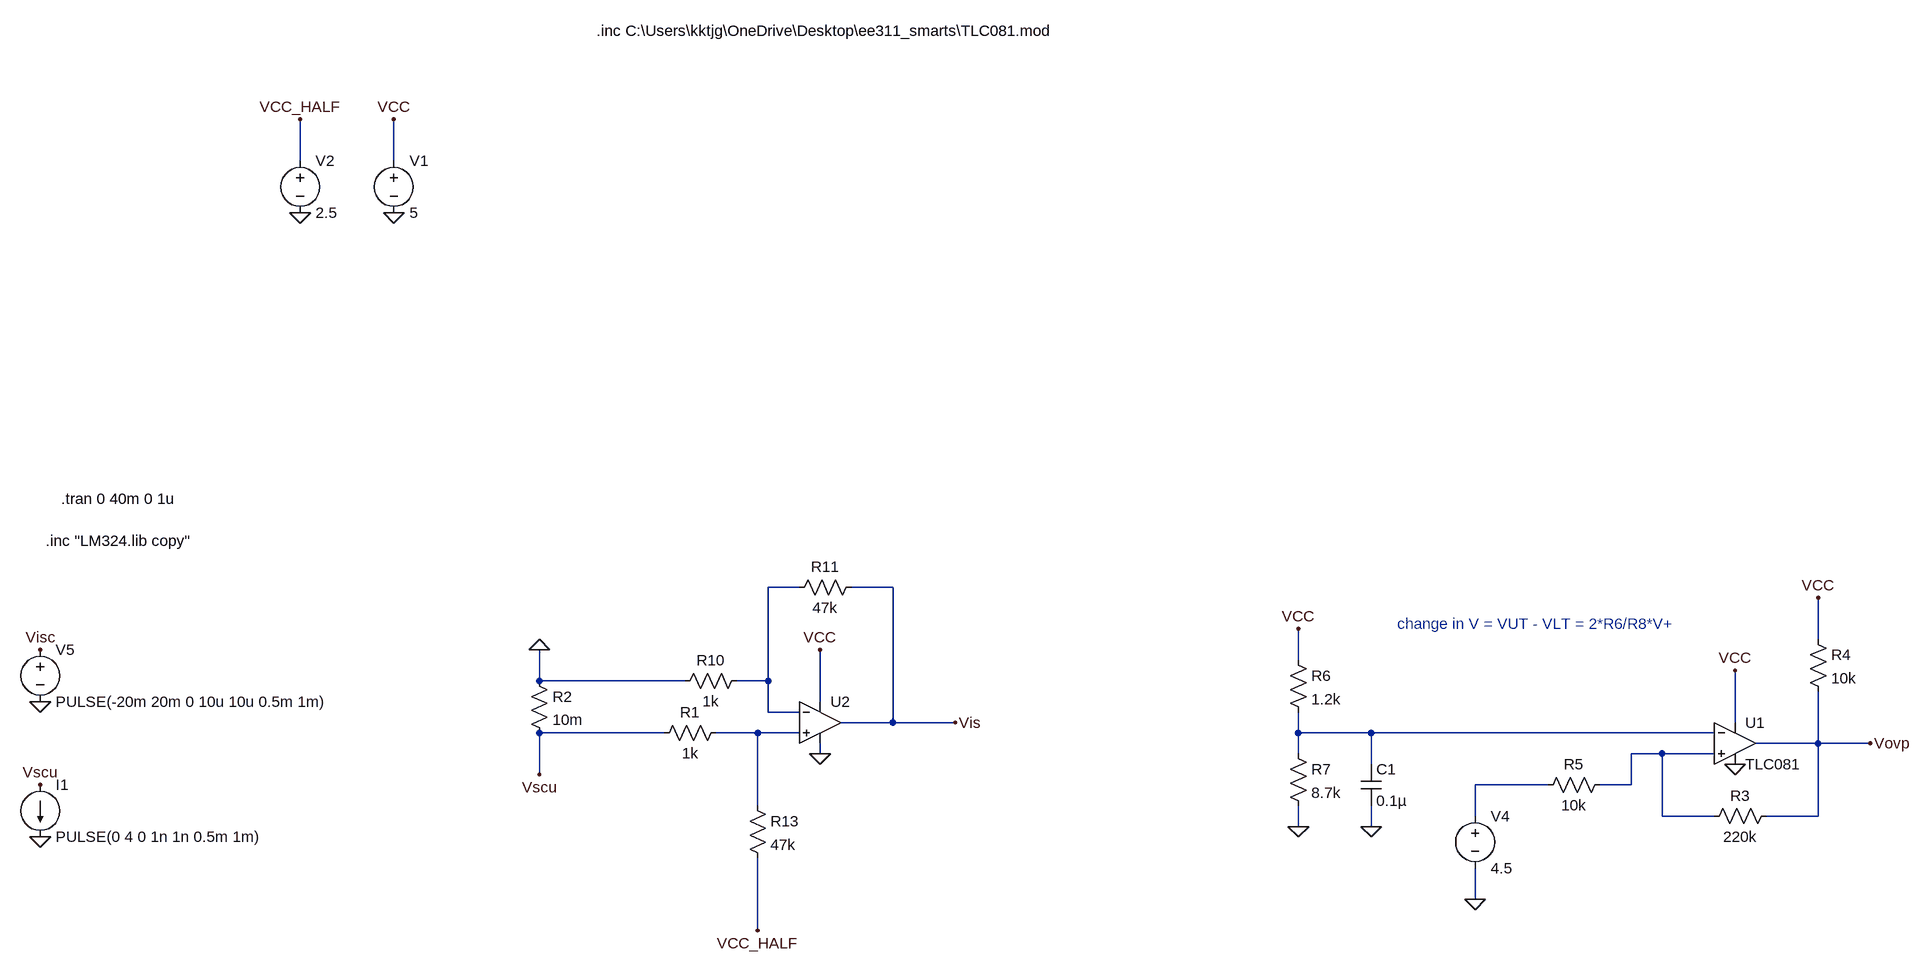
[diagram p0: schematic currentsensing.asc]
currentsensing.asc, the LTspice schematic file:
Version 4.1
SHEET 1 4088 1428
WIRE -736 -224 -736 -288
WIRE -592 -224 -592 -288
WIRE 32 432 -16 432
WIRE 176 432 112 432
WIRE 1600 512 1600 448
WIRE 800 544 800 496
WIRE -368 576 -368 528
WIRE -144 576 -368 576
WIRE -16 576 -16 432
WIRE -16 576 -64 576
WIRE 64 608 64 528
WIRE -16 624 -16 576
WIRE 32 624 -16 624
WIRE 176 640 176 432
WIRE 176 640 96 640
WIRE 272 640 176 640
WIRE 1472 640 1472 560
WIRE -176 656 -368 656
WIRE -32 656 -96 656
WIRE 32 656 -32 656
WIRE 800 656 800 624
WIRE 912 656 800 656
WIRE 1440 656 912 656
WIRE 1600 672 1600 592
WIRE 1600 672 1504 672
WIRE 1680 672 1600 672
WIRE 64 688 64 672
WIRE 800 688 800 656
WIRE 1360 688 1312 688
WIRE 1440 688 1360 688
WIRE 912 704 912 656
WIRE -368 720 -368 656
WIRE 1184 736 1072 736
WIRE 1312 736 1312 688
WIRE 1312 736 1264 736
WIRE -32 768 -32 656
WIRE 1072 784 1072 736
WIRE 1360 784 1360 688
WIRE 1440 784 1360 784
WIRE 1600 784 1600 672
WIRE 1600 784 1520 784
WIRE 800 800 800 768
WIRE 912 800 912 768
WIRE 1072 912 1072 864
WIRE -32 960 -32 848
FLAG -592 -144 0
FLAG -736 -144 0
FLAG -592 -288 VCC
FLAG -736 -288 VCC_HALF
FLAG 64 528 VCC
FLAG 272 640 Vis
FLAG -32 960 VCC_HALF
FLAG -1136 608 0
FLAG -1136 528 Visc
FLAG 64 688 0
FLAG -1136 816 0
FLAG -1136 736 Vscu
FLAG -368 528 0
FLAG -368 720 Vscu
FLAG 1680 672 Vovp
FLAG 1472 560 VCC
FLAG 1600 448 VCC
FLAG 800 800 0
FLAG 800 496 VCC
FLAG 912 800 0
FLAG 1472 704 0
FLAG 1072 912 0
SYMBOL voltage -592 -240 R0
WINDOW 123 0 0 Left 0
WINDOW 39 0 0 Left 0
SYMATTR InstName V1
SYMATTR Value 5
SYMBOL voltage -736 -240 R0
WINDOW 123 0 0 Left 0
WINDOW 39 0 0 Left 0
SYMATTR InstName V2
SYMATTR Value 2.5
SYMBOL res -48 560 R90
WINDOW 0 0 56 VBottom 2
WINDOW 3 32 56 VTop 2
SYMATTR InstName R10
SYMATTR Value 1k
SYMBOL res 128 416 R90
WINDOW 0 0 56 VBottom 2
WINDOW 3 32 56 VTop 2
SYMATTR InstName R11
SYMATTR Value 47k
SYMBOL res -48 752 R0
SYMATTR InstName R13
SYMATTR Value 47k
SYMBOL voltage -1136 512 R0
WINDOW 123 0 0 Left 0
WINDOW 39 0 0 Left 0
SYMATTR InstName V5
SYMATTR Value PULSE(-20m 20m 0 10u 10u 0.5m 1m)
SYMBOL res -80 640 R90
WINDOW 0 0 56 VBottom 2
WINDOW 3 32 56 VTop 2
SYMATTR InstName R1
SYMATTR Value 1k
SYMBOL OpAmps\\UniversalOpAmp2 64 640 R0
SYMATTR InstName U2
SYMBOL current -1136 736 R0
WINDOW 123 0 0 Left 0
WINDOW 39 0 0 Left 0
SYMATTR InstName I1
SYMATTR Value PULSE(0 4 0 1n 1n 0.5m 1m)
SYMBOL res -384 560 R0
SYMATTR InstName R2
SYMATTR Value 10m
SYMBOL res 1536 768 R90
WINDOW 0 0 56 VBottom 2
WINDOW 3 32 56 VTop 2
SYMATTR InstName R3
SYMATTR Value 220k
SYMBOL res 1584 496 R0
SYMATTR InstName R4
SYMATTR Value 10k
SYMBOL res 1280 720 R90
WINDOW 0 0 56 VBottom 2
WINDOW 3 32 56 VTop 2
SYMATTR InstName R5
SYMATTR Value 10k
SYMBOL res 784 528 R0
SYMATTR InstName R6
SYMATTR Value 1.2k
SYMBOL res 784 672 R0
SYMATTR InstName R7
SYMATTR Value 8.7k
SYMBOL cap 896 704 R0
SYMATTR InstName C1
SYMATTR Value 0.1µ
SYMBOL OpAmps\\opamp2 1472 608 R0
SYMATTR InstName U1
SYMATTR Value TLC081
SYMBOL voltage 1072 768 R0
WINDOW 123 0 0 Left 0
WINDOW 39 0 0 Left 0
SYMATTR InstName V4
SYMATTR Value 4.5
TEXT -1104 296 Left 2 !.tran 0 40m 0 1u
TEXT -280 -424 Left 2 !.inc C:\\Users\\kktjg\\OneDrive\\Desktop\\ee311_smarts\\TLC081.mod
TEXT -1128 360 Left 2 !.inc "LM324.lib copy"
TEXT 952 488 Left 2 ;change in V = VUT - VLT = 2*R6/R8*V+

The netlist it stands for:
* currentsensing.asc
V1 VCC 0 5
V2 VCC_HALF 0 2.5
R10 N001 0 1k
R11 Vis N001 47k
R13 N002 VCC_HALF 47k
V5 Visc 0 PULSE(-20m 20m 0 10u 10u 0.5m 1m)
R1 N002 Vscu 1k
X§U2 N002 N001 VCC 0 Vis level2 Avol=1Meg GBW=10Meg Slew=10Meg Ilimit=25m Rail=0 Vos=0 En=0 Enk=0 In=0 Ink=0 Rin=500Meg  ; pins In+ In- V+ V- OUT
I1 Vscu 0 PULSE(0 4 0 1n 1n 0.5m 1m)
R2 0 Vscu 10m
R3 Vovp N004 220k
R4 VCC Vovp 10k
R5 N004 N005 10k
R6 VCC N003 1.2k
R7 N003 0 8.7k
C1 N003 0 0.1µ
X§U1 N004 N003 VCC 0 Vovp TLC081  ; pins In+ In- V+ V- OUT
V4 N005 0 4.5
.tran 0 40m 0 1u
.inc C:\Users\kktjg\OneDrive\Desktop\ee311_smarts\TLC081.mod
.inc "LM324.lib copy"
* change in V = VUT - VLT = 2*R6/R8*V+
.lib UniversalOpAmp2.lib
.backanno
.end